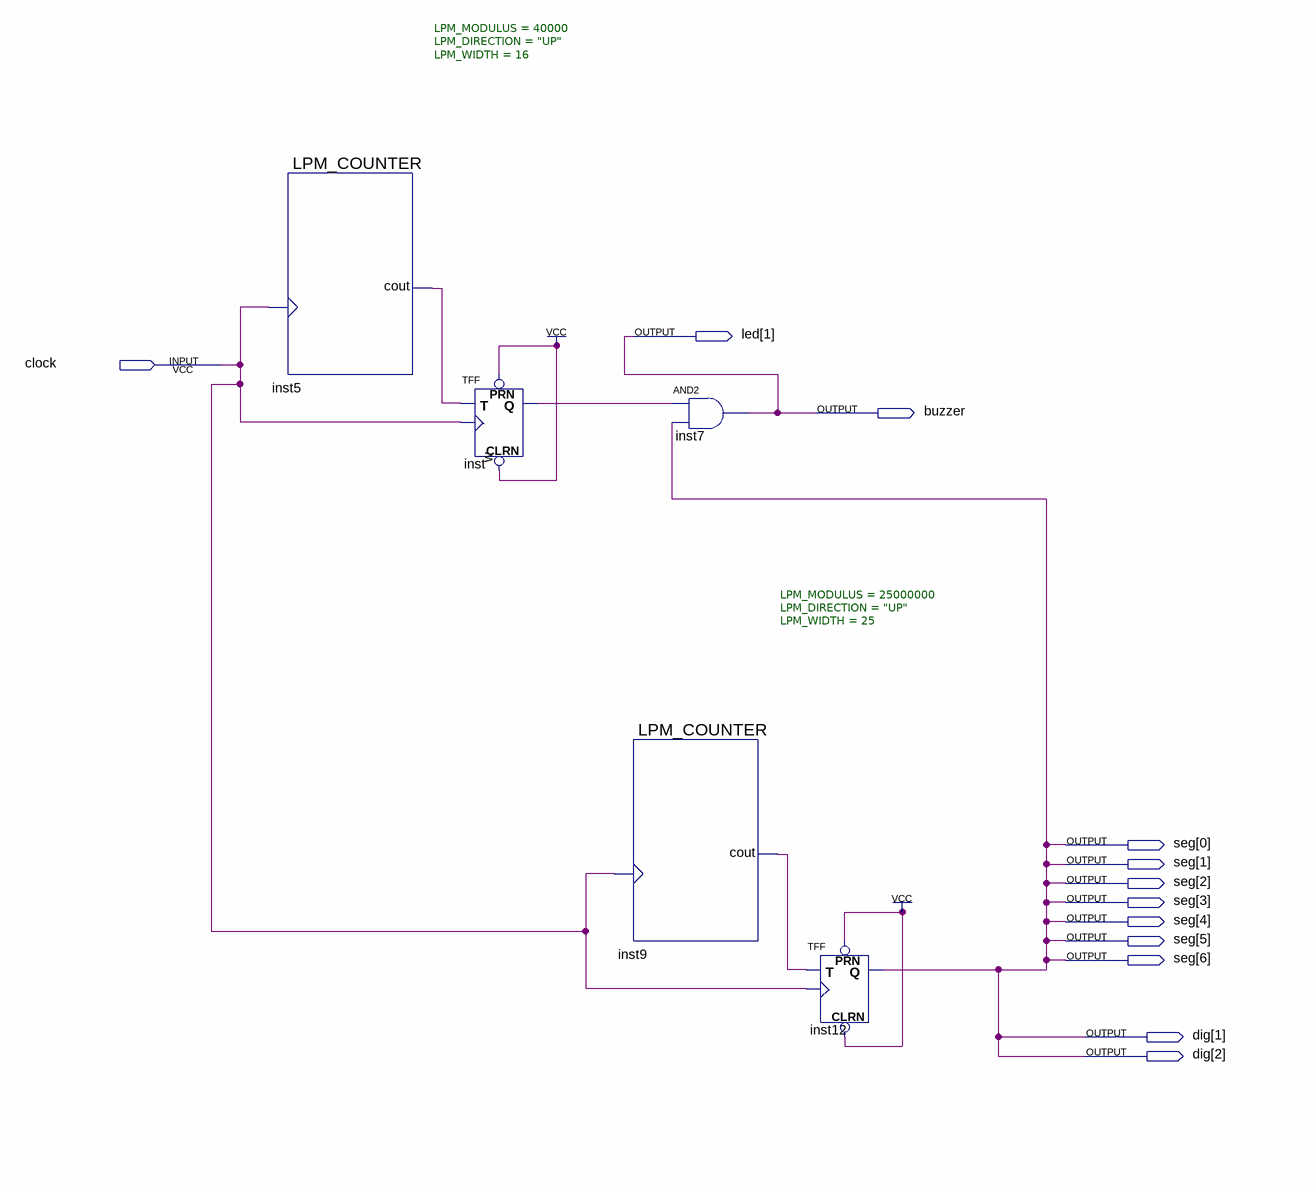
[diagram p0: schematic sheet]
// Quartus schematic jogo_de_velocidade.bdf as structural Verilog: 5 symbols, 12 pins
module jogo_de_velocidade (
  input  clock,
  output [1:1] led,
  output buzzer,
  output [6:0] seg,
  output [2:1] dig
);

  wire inst5_cout, inst9_cout, inst_q;

  LPM_COUNTER #(.LPM_MODULUS(40000), .LPM_DIRECTION("UP"), .LPM_WIDTH(16)) inst5 (.clock(clock), .cout(inst5_cout));
  TFF inst (.PRN(1'b1), .CLRN(1'b1), .T(inst5_cout), .CLK(clock), .Q(inst_q));
  LPM_COUNTER #(.LPM_MODULUS(25000000), .LPM_DIRECTION("UP"), .LPM_WIDTH(25)) inst9 (.clock(clock), .cout(inst9_cout));
  and inst7 (buzzer, inst_q, dig[2]);
  TFF inst12 (.PRN(1'b1), .CLRN(1'b1), .T(inst9_cout), .CLK(clock), .Q(dig[2]));

  assign dig[1] = dig[2];
  assign led[1] = buzzer;
  assign seg = {7{dig[2]}};
endmodule
